# EAGLE schematic nixieclk (EAGLE 6.3)
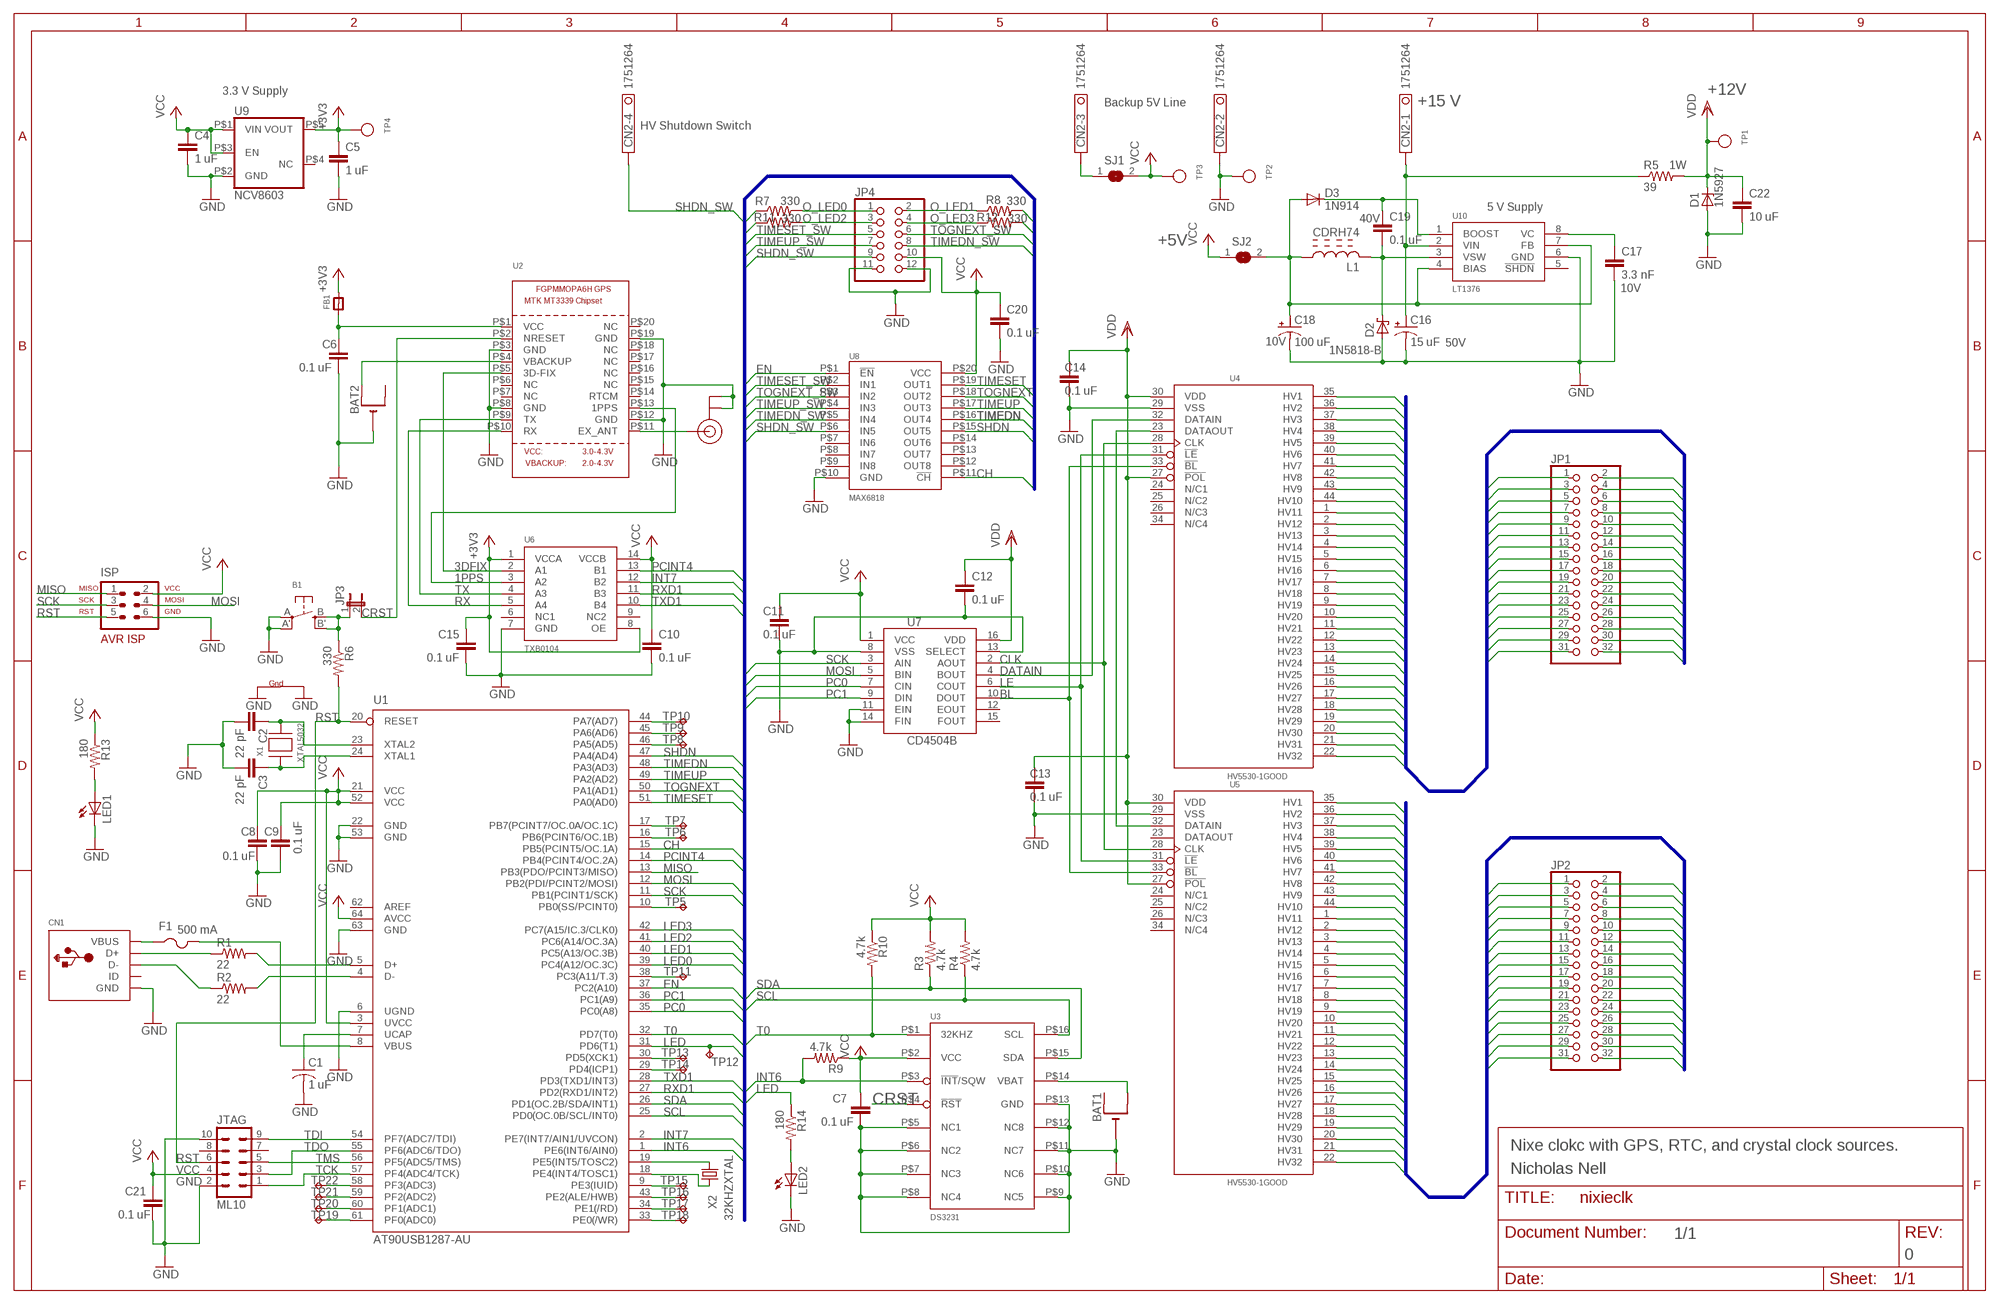
[diagram p0: schematic, sheet 1]

## Parts
ANT  U.FL  [U.FL]
B1  SWITCH_TACT_SMT  [EVQ-Q2]
BAT1  CR1220SMT  [CR1220-SMD]
BAT2  CR1220SMT  [CR1220-SMD]
C1  1 uF  C-USC0805  [C0805]
C2  22 pF  C-EUC0805  [C0805]
C3  22 pF  C-EUC0805  [C0805]
C4  1 uF  C-EUC0805  [C0805]
C5  1 uF  C-EUC0805  [C0805]
C6  0.1 uF  C-EUC0805  [C0805]
C7  0.1 uF  C-EUC0805  [C0805]
C8  0.1 uF  C-EUC0805  [C0805]
C9  0.1 uF  C-EUC0805  [C0805]
C10  0.1 uF  C-EUC0805  [C0805]
C11  0.1 uF  C-EUC0805  [C0805]
C12  0.1 uF  C-EUC0805  [C0805]
C13  0.1 uF  C-EUC0805  [C0805]
C14  0.1 uF  C-EUC0805  [C0805]
C15  0.1 uF  C-EUC0805  [C0805]
C16  15 uF  CPOL-USSMCE  [SMC_E]
C17  3.3 nF  C-EUC0805  [C0805]
C18  100 uF  CPOL-USSMCD  [SMC_D]
C19  0.1 uF  C-EUC1812  [C1812]
C20  0.1 uF  C-EUC0805  [C0805]
C21  0.1 uF  C-EUC0805  [C0805]
C22  10 uF  C-EUC0805  [C0805]
CN1  USBMINIB  [USB-MINIB]
CN2  1751264  [1751264]
D1  1N5927  ZENER-DIODEDO41Z10  [DO41Z10]
D2  1N5818-B  [DO41-7.6]
D3  1N914  [DO35-7]
F1  500 mA  PTCFUSE-1206  [R1206]
FB1  FERRITE_0805  [_0805]
ISP  AVR-ISP-6VERT  [AVR-ISP-6]
JP1  PINHD-2X16  [2X16]
JP2  PINHD-2X16  [2X16]
JP3  JUMPER2  [JUMPER2]
JP4  PINHD-2X6  [2X06]
JTAG  ML10  [ML10]
L1  CDRH74  [CDRH74]
LED1  LEDCHIPLED_0805  [CHIPLED_0805]
LED2  LEDCHIPLED_0805  [CHIPLED_0805]
R1  22  R-US_R0805  [R0805]
R2  22  R-US_R0805  [R0805]
R3  4.7k  R-US_R0805  [R0805]
R4  4.7k  R-US_R0805  [R0805]
R5  39  R-US_0207/10  [0207/10]
R6  330  R-US_R0805  [R0805]
R7  330  R-US_R0805  [R0805]
R8  330  R-US_R0805  [R0805]
R9  4.7k  R-US_R0805  [R0805]
R10  4.7k  R-US_R0805  [R0805]
R11  330  R-US_R0805  [R0805]
R12  330  R-US_R0805  [R0805]
R13  180  R-US_R0805  [R0805]
R14  180  R-US_R0805  [R0805]
SJ1  SJ  [SJ]
SJ2  SJ  [SJ]
TP1  TESTPOINT0.1"  [1X01_ROUND]
TP2  TESTPOINT0.1"  [1X01_ROUND]
TP3  TESTPOINT0.1"  [1X01_ROUND]
TP4  TESTPOINT0.1"  [1X01_ROUND]
TP5  TPTP08R  [TP08R]
TP6  TPTP08R  [TP08R]
TP7  TPTP08R  [TP08R]
TP8  TPTP08R  [TP08R]
TP9  TPTP08R  [TP08R]
TP10  TPTP08R  [TP08R]
TP11  TPTP08R  [TP08R]
TP12  TPTP08R  [TP08R]
TP13  TPTP08R  [TP08R]
TP14  TPTP08R  [TP08R]
TP15  TPTP08R  [TP08R]
TP16  TPTP08R  [TP08R]
TP17  TPTP08R  [TP08R]
TP18  TPTP08R  [TP08R]
TP19  TPTP08R  [TP08R]
TP20  TPTP08R  [TP08R]
TP21  TPTP08R  [TP08R]
TP22  TPTP08R  [TP08R]
U1  AT90USB1287-AU  [TQFP64]
U2  GPS_FGPMMOPA6H  [FGPMMOPA6H]
U3  DS3231  [DS3231]
U4  HV5530-1GOOD  [HV5530-PQFP-44]
U5  HV5530-1GOOD  [HV5530-PQFP-44]
U6  TXB0104  [SOIC14]
U7  CD4504B  [SO-16]
U8  MAX6818  [SSOP20]
U9  NCV8603  [TSOP5]
U10  LT1376  [S8]
X1  XTAL5032  [SX5032]
X2  32KHZXTAL  [FX135]

## Nets
1PPS: U2.P$13(1PPS) U6.3(A2)
2HV1: JP2.1 U5.35(HV1)
2HV2: JP2.2 U5.36(HV2)
2HV3: JP2.3 U5.37(HV3)
2HV4: JP2.4 U5.38(HV4)
2HV5: JP2.5 U5.39(HV5)
2HV6: JP2.6 U5.40(HV6)
2HV7: JP2.7 U5.41(HV7)
2HV8: JP2.8 U5.42(HV8)
2HV9: JP2.9 U5.43(HV9)
2HV10: JP2.10 U5.44(HV10)
2HV11: JP2.11 U5.1(HV11)
2HV12: JP2.12 U5.2(HV12)
2HV13: JP2.13 U5.3(HV13)
2HV14: JP2.14 U5.4(HV14)
2HV15: JP2.15 U5.5(HV15)
2HV16: JP2.16 U5.6(HV16)
2HV17: JP2.17 U5.7(HV17)
2HV18: JP2.18 U5.8(HV18)
2HV19: JP2.19 U5.9(HV19)
2HV20: JP2.20 U5.10(HV20)
2HV21: JP2.21 U5.11(HV21)
2HV22: JP2.22 U5.12(HV22)
2HV23: JP2.23 U5.13(HV23)
2HV24: JP2.24 U5.14(HV24)
2HV25: JP2.25 U5.15(HV25)
2HV26: JP2.26 U5.16(HV26)
2HV27: JP2.27 U5.17(HV27)
2HV28: JP2.28 U5.18(HV28)
2HV29: JP2.29 U5.19(HV29)
2HV30: JP2.30 U5.20(HV30)
2HV31: JP2.31 U5.21(HV31)
2HV32: JP2.32 U5.22(HV32)
3DFIX: U2.P$5(3D-FIX) U6.2(A1)
+3V3: C5.1 C15.1 FB1.2 TP4.1 U6.1(VCCA) U6.8(OE) U9.P$5(VOUT)
BL: U4.33(!BL) U5.33(!BL) U7.10(DOUT)
BOOST: C19.1 D3.P$1(C) U10.1(BOOST)
CH: U1.15(PB5(PCINT5/OC.1A)) U8.P$11(!CH)
CLK: U4.28(CLK) U5.28(CLK) U7.2(AOUT)
CRST: JP3.2 U2.P$2(NRESET) U3.P$4(!RST)
DATAIN: U4.32(DATAIN) U7.4(BOUT)
EN: U1.37(PC2(A10)) U8.P$1(!EN)
GND: ANT.1(GND) ANT.2(GND) B1.A'(P1) B1.A(P) BAT1.- BAT2.- C1.2 C2.2 C3.2 C4.2 C5.2 C6.2 C7.2 C8.2 C9.2 C10.2 C11.2 C12.2 C13.2 C14.2 C15.2 C16.- C17.2 C18.- C20.2 C21.2 C22.2 CN1.GND CN2.2 D1.A D2.A ISP.6 JP4.11 JP4.12 JTAG.2 JTAG.10 LED1.C LED2.C TP2.1 U1.6(UGND) U1.22(GND) U1.53(GND) U1.63(GND) U2.P$3(GND) U2.P$8(GND) U2.P$12(GND) U2.P$19(GND) U3.P$5(NC1) U3.P$6(NC2) U3.P$7(NC3) U3.P$8(NC4) U3.P$9(NC5) U3.P$10(NC6) U3.P$11(NC7) U3.P$12(NC8) U3.P$13(GND) U4.29(VSS) U5.29(VSS) U6.7(GND) U7.8(VSS) U7.11(EIN) U7.13(SELECT) U7.14(FIN) U8.P$10(GND) U9.P$2(GND) U10.6(GND) X1.P$2(G1) X1.P$4(G2)
HV1: JP1.1 U4.35(HV1)
HV2: JP1.2 U4.36(HV2)
HV3: JP1.3 U4.37(HV3)
HV4: JP1.4 U4.38(HV4)
HV5: JP1.5 U4.39(HV5)
HV6: JP1.6 U4.40(HV6)
HV7: JP1.7 U4.41(HV7)
HV8: JP1.8 U4.42(HV8)
HV9: JP1.9 U4.43(HV9)
HV10: JP1.10 U4.44(HV10)
HV11: JP1.11 U4.1(HV11)
HV12: JP1.12 U4.2(HV12)
HV13: JP1.13 U4.3(HV13)
HV14: JP1.14 U4.4(HV14)
HV15: JP1.15 U4.5(HV15)
HV16: JP1.16 U4.6(HV16)
HV17: JP1.17 U4.7(HV17)
HV18: JP1.18 U4.8(HV18)
HV19: JP1.19 U4.9(HV19)
HV20: JP1.20 U4.10(HV20)
HV21: JP1.21 U4.11(HV21)
HV22: JP1.22 U4.12(HV22)
HV23: JP1.23 U4.13(HV23)
HV24: JP1.24 U4.14(HV24)
HV25: JP1.25 U4.15(HV25)
HV26: JP1.26 U4.16(HV26)
HV27: JP1.27 U4.17(HV27)
HV28: JP1.28 U4.18(HV28)
HV29: JP1.29 U4.19(HV29)
HV30: JP1.30 U4.20(HV30)
HV31: JP1.31 U4.21(HV31)
HV32: JP1.32 U4.22(HV32)
INT6: R9.2 U1.1(PE6(INT6/AIN0)) U3.P$3(!INT!/SQW)
INT7: U1.2(PE7(INT7/AIN1/UVCON)) U6.12(B2)
LE: U4.31(!LE) U5.31(!LE) U7.6(COUT)
LED: R14.1 TP12.TP U1.31(PD6(T1))
LED0: R7.1 U1.39(PC4(A12/OC.3C))
LED1: R8.2 U1.40(PC5(A13/OC.3B))
LED2: R11.1 U1.41(PC6(A14/OC.3A))
LED3: R12.2 U1.42(PC7(A15/IC.3/CLK0))
MISO: ISP.1 U1.13(PB3(PDO/PCINT3/MISO))
MOSI: ISP.4 U1.12(PB2(PDI/PCINT2/MOSI)) U7.5(BIN)
N$1: R1.2 U1.5(D+)
N$2: R2.2 U1.4(D-)
N$3: CN1.D+ R1.1
N$4: CN1.D- R2.1
N$5: F1.2 U1.8(VBUS)
N$6: C16.+ CN2.1 R5.1 U10.2(VIN)
N$7: U4.23(DATAOUT) U5.32(DATAIN)
N$8: B1.B'(S1) B1.B(S) JP3.1 R6.1
N$9: ANT.3(SIGNAL) U2.P$11(EX_ANT)
N$10: BAT1.+$2(+1) U3.P$14(VBAT)
N$11: BAT2.+$1(+) U2.P$4(VBACKUP)
N$12: C1.1 U1.7(UCAP)
N$13: C6.1 FB1.1 U2.P$1(VCC)
N$14: C2.1 U1.23(XTAL2) X1.P$3(X2)
N$15: TP5.TP U1.10(PB0(SS/PCINT0))
N$16: TP6.TP U1.16(PB6(PCINT6/OC.1B))
N$17: TP7.TP U1.17(PB7(PCINT7/OC.0A/OC.1C))
N$18: C3.1 U1.24(XTAL1) X1.P$1(X1)
N$19: C19.2 D2.C L1.P$2 U10.3(VSW)
N$20: C17.1 U10.8(VC)
N$21: TP8.TP U1.46(PA5(AD5))
N$22: TP9.TP U1.45(PA6(AD6))
N$23: TP10.TP U1.44(PA7(AD7))
N$24: U1.18(PE4(INT4/TOSC1)) X2.P$1
N$25: U1.19(PE5(INT5/TOSC2)) X2.P$2
N$26: TP11.TP U1.38(PC3(A11/T.3))
N$27: C18.+ D3.P$2(A) L1.P$1 SJ2.2 U10.4(BIAS) U10.7(FB)
N$28: TP13.TP U1.30(PD5(XCK1))
N$29: TP14.TP U1.29(PD4(ICP1))
N$30: TP15.TP U1.9(PE3(IUID))
N$31: TP16.TP U1.43(PE2(ALE/HWB))
N$32: TP17.TP U1.34(PE1(/RD))
N$33: TP18.TP U1.33(PE0(/WR))
N$34: TP19.TP U1.61(PF0(ADC0))
N$35: TP20.TP U1.60(PF1(ADC1))
N$36: TP21.TP U1.59(PF2(ADC2))
N$37: TP22.TP U1.58(PF3(ADC3))
N$38: CN2.3 SJ1.1
N$39: LED1.A R13.2
N$41: CN1.VBUS F1.1
N$42: LED2.A R14.2
O_LED0: JP4.1 R7.2
O_LED1: JP4.2 R8.1
O_LED2: JP4.3 R11.2
O_LED3: JP4.4 R12.1
PC0: U1.35(PC0(A8)) U7.7(CIN)
PC1: U1.36(PC1(A9)) U7.9(DIN)
PCINT4: U1.14(PB4(PCINT4/OC.2A)) U6.13(B1)
RST: ISP.5 JTAG.6 R6.2 U1.20(RESET)
RX: U2.P$10(RX) U6.5(A4)
RXD1: U1.27(PD2(RXD1/INT2)) U6.11(B3)
SCK: ISP.3 U1.11(PB1(PCINT1/SCK)) U7.3(AIN)
SCL: R4.1 U1.25(PD0(OC.0B/SCL/INT0)) U3.P$16(SCL)
SDA: R3.1 U1.26(PD1(OC.2B/SDA/INT1)) U3.P$15(SDA)
SHDN: U1.47(PA4(AD4)) U8.P$15(OUT5)
SHDN_SW: CN2.4 JP4.9 U8.P$6(IN5)
T0: R10.2 U1.32(PD7(T0)) U3.P$1(32KHZ)
TCK: JTAG.1 U1.57(PF4(ADC4/TCK))
TDI: JTAG.9 U1.54(PF7(ADC7/TDI))
TDO: JTAG.3 U1.55(PF6(ADC6/TDO))
TIMEDN: U1.48(PA3(AD3)) U8.P$16(OUT4)
TIMEDN_SW: JP4.8 U8.P$5(IN4)
TIMESET: U1.51(PA0(AD0)) U8.P$19(OUT1)
TIMESET_SW: JP4.5 U8.P$2(IN1)
TIMEUP: U1.49(PA2(AD2)) U8.P$17(OUT3)
TIMEUP_SW: JP4.7 U8.P$4(IN3)
TMS: JTAG.5 U1.56(PF5(ADC5/TMS))
TOGNEXT: U1.50(PA1(AD1)) U8.P$18(OUT2)
TOGNEXT_SW: JP4.6 U8.P$3(IN2)
TX: U2.P$9(TX) U6.4(A3)
TXD1: U1.28(PD3(TXD1/INT3)) U6.10(B4)
VCC: C4.1 C7.1 C8.1 C9.1 C10.1 C11.1 C20.1 C21.1 ISP.2 JP4.10 JTAG.4 R3.2 R4.2 R9.1 R10.1 R13.1 SJ1.2 SJ2.1 TP3.1 U1.3(UVCC) U1.21(VCC) U1.52(VCC) U1.64(AVCC) U3.P$2(VCC) U6.14(VCCB) U7.1(VCC) U8.P$20(VCC) U9.P$1(VIN) U9.P$3(EN)
VDD: C12.1 C13.1 C14.1 C22.1 D1.C R5.2 TP1.1 U4.27(!POL) U4.30(VDD) U5.27(!POL) U5.30(VDD) U7.16(VDD)
Unconnected: BAT1.+$1(+) BAT2.+$2(+1) CN1.ID JTAG.7 JTAG.8 U1.62(AREF) U2.P$6(NC) U2.P$7(NC) U2.P$14(RTCM) U2.P$15(NC) U2.P$16(NC) U2.P$17(NC) U2.P$18(NC) U2.P$20(NC) U4.24(N/C1) U4.25(N/C2) U4.26(N/C3) U4.34(N/C4) U5.23(DATAOUT) U5.24(N/C1) U5.25(N/C2) U5.26(N/C3) U5.34(N/C4) U6.6(NC1) U6.9(NC2) U7.12(EOUT) U7.15(FOUT) U8.P$7(IN6) U8.P$8(IN7) U8.P$9(IN8) U8.P$12(OUT8) U8.P$13(OUT7) U8.P$14(OUT6) U9.P$4(NC) U10.5(!SHDN)

## Buses
HV[1..32]
2HV[1..32]
PCINT4,MISO,MOSI,SCK,PC1,PC0,T0,TXD1,RXD1,SCL,SDA,INT7,INT6,TOSC1,TOSC2,LED0,LED1,LED2,LED3,TIMESET,TOGNEXT,TIMEUP,TIMEDN,SHDN,TIMESET_SW,TOGNEXT_SW,TIMEUP_SW,TIMEDN_SW,SHDN_SW,CH,EN,LED

## Notes on the sheet
- 3.3 V Supply | +12V
- Backup 5V Line | +15 V
- HV Shutdown Switch
- 1W
- 5 V Supply
- 40V
- +5V
- 10V
- 10V | 50V
- Nixe clokc with GPS, RTC, and crystal clock sources.
- Nicholas Nell
- 1/1
- 0

## Library data of the parts
ANT = microbuilder:U.FL: U.FL Antenna Connector
B1 = microbuilder:SWITCH_TACT_SMT: SMT Tact Switches 6x6mm - Digikey: P12940SCT-ND KMR2 (4.6x2.8mm) - Digikey: 401-1426-1-ND EVQ-PQHB55 - Light Touch, 160GF (4.5x4.5mm) - Digikey: P8090SCT-ND
BAT1 BAT2 = adafruit:CR1220: CR1216/CR1220/CR1225 12mm 3V lithium coin cell Great for battery packup. Both SMT and THM holders. Note the THM package has the ground pads on both sides of the PCB so that the masks are the same - this reduces the cost
C1 = adafruit:C-US: CAPACITOR, American symbol
C2-C15 C17 C19-C22 = rcl:C-EU: CAPACITOR, European symbol
C16 C18 = rcl:CPOL-US: POLARIZED CAPACITOR, American symbol
CN1 = adafruit:USB: USB Connectors USBMINIB - Surface Mount Female Mini-B USB Connector 4UConnector: 06564 By microbuilder.eu Thru-hole RA Female Mini-B USB Connector 4UConnector: 18732 By ladyada.net
CN2 = con-phoenix-350:1751264: MKDS 1/ 4-3,5 Printklemme Nennstrom: 10 A Bemessungsspannung: 160 V Raster: 3,5 mm Polzahl: 4 Montageart: Löten Anschlussart: Schraubanschluss Anschlussrichtung vom Leiter zur Platine: 0° Source: http://eshop.phoenixcontact.com .. 1751264.pdf; MPN: 1751264; OC_FARNELL: unknown; OC_NEWARK: 10R0934
D1 = diode:ZENER-DIODE: Z-Diode
D2 = diode:1N581*: 1.0A SCHOTTKY BARRIER RECTIFIER Source: http://www.diodes.com/datasheets/ds23001.pdf
D3 = nico:1N914
F1 = adafruit:PTCFUSE: PTC fuses, resettable thermistors
FB1 = microbuilder:FERRITE: Ferrite Bead 0603 MMZ1608B121C - 120 Ohm @ 100MHz, 600mA, 0.15 Ohm DC Resistance - Digikey: 445-2164-1-ND BK1608HW121-T - 120 Ohm, 600mA Ferrite Chip - Digikey: 587-1876-2-ND 0805 HZ0805B272R-10 - 2.7K Ohm @ 100MHz, 200mA, 0.8 Ohm DC Resistance - Digikey: 240-2504-1-ND (see also Murata BLM21BD272SN1L) MMZ2012Y152B - 1.5K Ohm @ 100MHz, 500mA, 0.4 Ohm DC Resistance - Digikey: 445-1560-1-ND - Mainly for high frequency (80-400MHz) MMZ2012R102A - 1K Ohm @ 100MHz, 500mA, 0.3 Ohm DC Resistance - Digikey: 445-1555-2-ND - More general purpose (10-200MHz)
ISP = avr-7:AVR-ISP-6: AVR ISP-6 Serial Programming Header
JP1 JP2 = nico:PINHD-2X16: PIN HEADER
JP3 = microbuilder:JUMPER2: JUMPER - 2 Pins
JP4 = pinhead:PINHD-2X6: PIN HEADER
JTAG = nico:ML10
L1 = nico:CDRH74
LED1 LED2 = adafruit:LED: LED OSRAM: - CHIPLED LG R971, LG N971, LY N971, LG Q971, LY Q971, LO R971, LY R971 LH N974, LH R974 LS Q976, LO Q976, LY Q976 LO Q996 - Hyper CHIPLED LW Q18S LB Q993, LB Q99A, LB R99A - SideLED LS A670, LO A670, LY A670, LG A670, LP A670 LB A673, LV A673, LT A673, LW A673 LH A674 LY A675 LS A676, LA A676, LO A676, LY A676, LW A676 LS A679, LY A679, LG A679 - Hyper Micro SIDELED® LS Y876, LA Y876, LO Y876, LY Y876 LT Y87S - SmartLED LW L88C, LW L88S LB L89C, LB L89S, LG L890 LS L89K, LO L89K, LY L89K LS L896, LA L896, LO L896, LY L896 - TOPLED LS T670, LO T670, LY T670, LG T670, LP T670 LSG T670, LSP T670, LSY T670, LOP T670, LYG T670 LG T671, LOG T671, LSG T671 LB T673, LV T673, LT T673, LW T673 LH T674 LS T676, LA T676, LO T676, LY T676, LB T676, LH T676, LSB T676, LW T676 LB T67C, LV T67C, LT T67C, LS T67K, LO T67K, LY T67K, LW E67C LS E67B, LA E67B, LO E67B, LY E67B, LB E67C, LV E67C, LT E67C LW T67C LS T679, LY T679, LG T679 LS T770, LO T770, LY T770, LG T770, LP T770 LB T773, LV T773, LT T773, LW T773 LH T774 LS E675, LA E675, LY E675, LS T675 LS T776, LA T776, LO T776, LY T776, LB T776 LHGB T686 LT T68C, LB T68C - Hyper Mini TOPLED® LB M676 - Mini TOPLED Santana® LG M470 LS M47K, LO M47K, LY M47K Source: http://www.osram.convergy.de/
R1-R4 R6-R14 = adafruit:R-US_: RESISTOR, American symbol
R5 = resistor:R-US_: RESISTOR, American symbol
SJ1 SJ2 = jumper:SJ: SMD solder JUMPER
TP1-TP4 = microbuilder:TESTPOINT: Test Point Various test points for characterisation and PCB testing TESTPOINT_SMT - Compact Surface Mount Test Point [Digikey: 5016KTR-ND]; BOM: EXCLUDE
TP5-TP22 = testpad:TP: Test pad
U1 = at90usb:AT90USB1287-*: Atmel AT90USB1287 AVR Microcontroller with USB Interface and 128kB Flash Memory
U2 = adafruit:GPS_FGPMMOPA6H: GPS Module - MTK MT3339 Chipset, -165dBm sensitivity, 22 channels, 10Hz, auto-select external antenna options
U3 = nico-chips:DS3231
U4 U5 = nico-chips:HV5530-1
U6 = nico-chips:TXB0104
U7 = nico-chips:CD4504B
U8 = nico-chips:MAX6818
U9 = nico-chips:NCV8603
U10 = nico-chips:LT1376
X1 = nico:XTAL5032
X2 = nico:32KHZXTAL